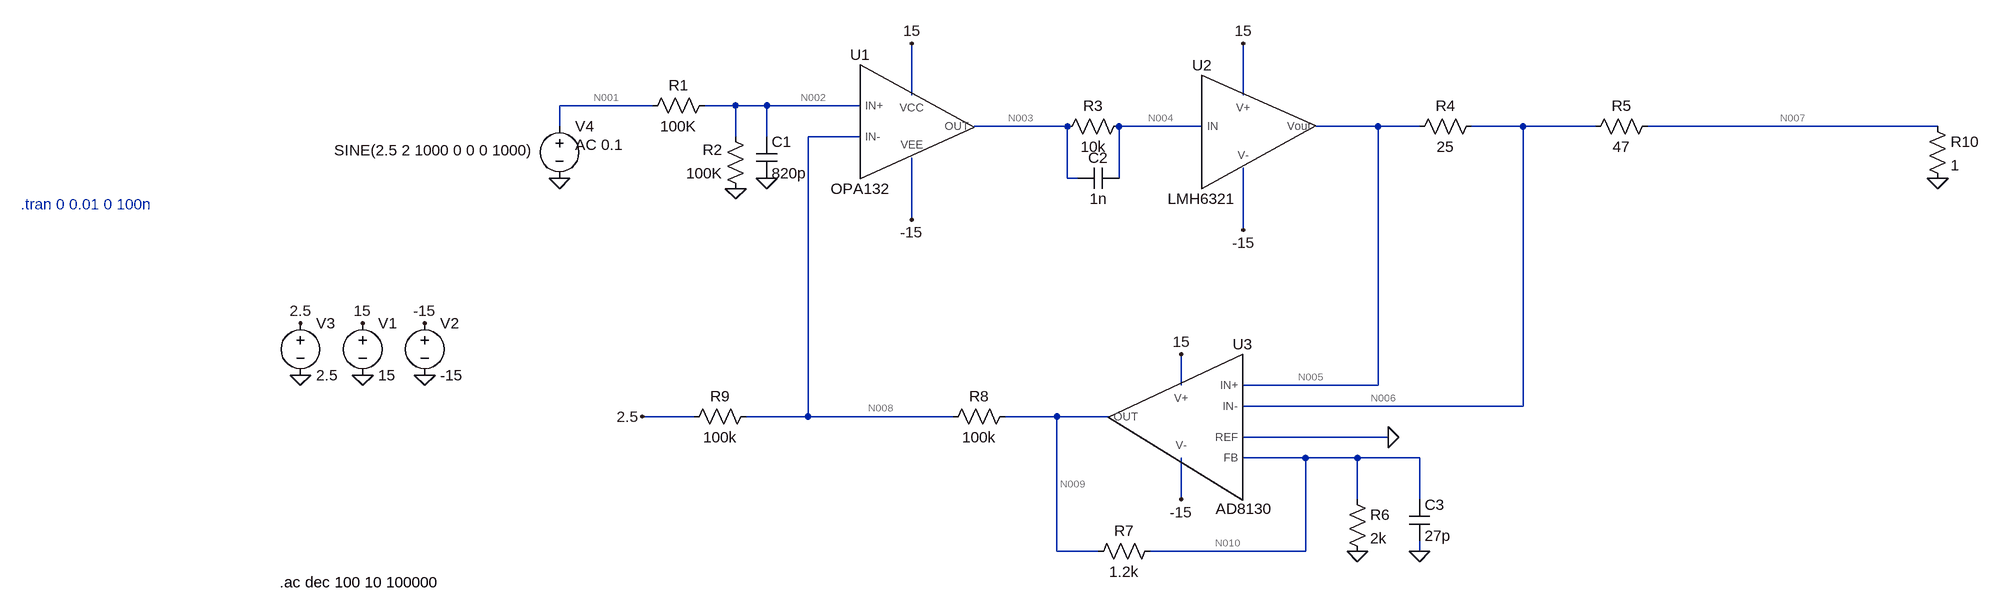
[diagram p0: schematic current_driver_OLoop.asc]
current_driver_OLoop.asc, the LTspice schematic file:
Version 4
SHEET 1 2244 900
WIRE 592 128 592 48
WIRE 1104 128 1104 48
WIRE 192 144 48 144
WIRE 320 144 272 144
WIRE 368 144 320 144
WIRE 512 144 368 144
WIRE 48 176 48 144
WIRE 832 176 688 176
WIRE 1040 176 912 176
WIRE 1312 176 1216 176
WIRE 1376 176 1312 176
WIRE 1536 176 1456 176
WIRE 1648 176 1536 176
WIRE 2176 176 1728 176
WIRE 320 192 320 144
WIRE 368 192 368 144
WIRE 512 192 432 192
WIRE 832 256 832 176
WIRE 848 256 832 256
WIRE 912 256 912 176
WIRE 592 320 592 224
WIRE 1104 336 1104 240
WIRE 1008 576 1008 528
WIRE 1312 576 1312 176
WIRE 1312 576 1104 576
WIRE 1536 608 1536 176
WIRE 1536 608 1104 608
WIRE 256 624 176 624
WIRE 432 624 432 192
WIRE 432 624 336 624
WIRE 656 624 432 624
WIRE 816 624 736 624
WIRE 896 624 816 624
WIRE 1328 656 1104 656
WIRE 1200 688 1104 688
WIRE 1280 688 1200 688
WIRE 1376 688 1280 688
WIRE 1008 752 1008 688
WIRE 1280 752 1280 688
WIRE 1376 752 1376 688
WIRE 816 832 816 624
WIRE 880 832 816 832
WIRE 1200 832 1200 688
WIRE 1200 832 960 832
WIRE 1376 832 1376 816
FLAG 320 272 0
FLAG 368 256 0
FLAG -256 560 0
FLAG -160 560 0
FLAG -256 480 15
FLAG -160 480 -15
FLAG 592 48 15
FLAG 592 320 -15
FLAG 1104 48 15
FLAG 1104 336 -15
FLAG 1328 656 0
FLAG 1280 832 0
FLAG 1376 832 0
FLAG -352 560 0
FLAG -352 480 2.5
FLAG 176 624 2.5
FLAG 2176 256 0
FLAG 48 256 0
FLAG 1008 528 15
FLAG 1008 752 -15
SYMBOL res 288 128 R90
WINDOW 0 0 56 VBottom 2
WINDOW 3 32 56 VTop 2
SYMATTR InstName R1
SYMATTR Value 100K
SYMBOL res 336 288 R180
WINDOW 0 36 76 Left 2
WINDOW 3 36 40 Left 2
SYMATTR InstName R2
SYMATTR Value 100K
SYMBOL cap 352 192 R0
SYMATTR InstName C1
SYMATTR Value 820p
SYMBOL voltage -256 464 R0
WINDOW 123 0 0 Left 2
WINDOW 39 0 0 Left 2
SYMATTR InstName V1
SYMATTR Value 15
SYMBOL voltage -160 464 R0
WINDOW 123 0 0 Left 2
WINDOW 39 0 0 Left 2
SYMATTR InstName V2
SYMATTR Value -15
SYMBOL res 928 160 R90
WINDOW 0 0 56 VBottom 2
WINDOW 3 32 56 VTop 2
SYMATTR InstName R3
SYMATTR Value 10k
SYMBOL cap 912 240 R90
WINDOW 0 0 32 VBottom 2
WINDOW 3 32 32 VTop 2
SYMATTR InstName C2
SYMATTR Value 1n
SYMBOL AutoGenerated\\OPA132 592 160 R0
SYMATTR InstName U1
SYMBOL AutoGenerated\\LMH6321 1104 176 R0
SYMATTR InstName U2
SYMBOL res 1472 160 R90
WINDOW 0 0 56 VBottom 2
WINDOW 3 32 56 VTop 2
SYMATTR InstName R4
SYMATTR Value 25
SYMBOL res 1744 160 R90
WINDOW 0 0 56 VBottom 2
WINDOW 3 32 56 VTop 2
SYMATTR InstName R5
SYMATTR Value 47
SYMBOL AutoGenerated\\AD8130 1072 640 M0
SYMATTR InstName U3
SYMBOL res 1264 736 R0
SYMATTR InstName R6
SYMATTR Value 2k
SYMBOL cap 1360 752 R0
SYMATTR InstName C3
SYMATTR Value 27p
SYMBOL res 976 816 R90
WINDOW 0 0 56 VBottom 2
WINDOW 3 32 56 VTop 2
SYMATTR InstName R7
SYMATTR Value 1.2k
SYMBOL res 752 608 R90
WINDOW 0 0 56 VBottom 2
WINDOW 3 32 56 VTop 2
SYMATTR InstName R8
SYMATTR Value 100k
SYMBOL res 352 608 R90
WINDOW 0 0 56 VBottom 2
WINDOW 3 32 56 VTop 2
SYMATTR InstName R9
SYMATTR Value 100k
SYMBOL voltage -352 464 R0
WINDOW 123 0 0 Left 2
WINDOW 39 0 0 Left 2
SYMATTR InstName V3
SYMATTR Value 2.5
SYMBOL res 2160 160 R0
SYMATTR InstName R10
SYMATTR Value 1
SYMBOL voltage 48 160 R0
WINDOW 3 -348 53 Left 2
WINDOW 123 24 44 Left 2
WINDOW 39 0 0 Left 2
SYMATTR Value SINE(2.5 2 1000 0 0 0 1000)
SYMATTR Value2 AC 0.1
SYMATTR InstName V4
TEXT -384 880 Left 2 !.ac dec 100 10 100000
TEXT -784 296 Left 2 ;.tran 0 0.01 0 100n

The netlist it stands for:
* current_driver_OLoop.asc
R1 N002 N001 100K
R2 0 N002 100K
C1 N002 0 820p
V1 15 0 15
V2 -15 0 -15
R3 N004 N003 10k
C2 N004 N003 1n
XU1 N002 N008 15 -15 N003 OPA132  ; pins IN+ IN- VCC VEE OUT
XU2 N004 15 -15 N005 LMH6321  ; pins IN V+ V- Vout
R4 N006 N005 25
R5 N007 N006 47
XU3 N005 N006 0 N010 15 -15 N009 AD8130  ; pins IN+ IN- REF FB V+ V- OUT
R6 N010 0 2k
C3 N010 0 27p
R7 N010 N009 1.2k
R8 N009 N008 100k
R9 N008 2.5 100k
V3 2.5 0 2.5
R10 N007 0 1
V4 N001 0 SINE(2.5 2 1000 0 0 0 1000) AC 0.1
.ac dec 100 10 100000
* .tran 0 0.01 0 100n
.lib C:\Users\Jorge\Desktop\OPA132.LIB
.lib C:\Users\Jorge\Desktop\LMH6321.MOD
.lib C:\Users\Jorge\Desktop\ad8130.cir
.backanno
.end

* Results of the author's LTspice run, read from the files saved beside the schematic
* Operating Point, zero values left out:
*   V(n002) = 1.25 V
*   V(n001) = 2.5 V
*   V(15) = 15 V
*   V(-15) = -15 V
*   V(n004) = -6.616 mV
*   V(n003) = -22.02 mV
*   V(n008) = 1.25 V
*   V(n005) = -9.83 mV
*   V(n006) = -6.471 mV
*   V(n007) = -134.8 µV
*   V(n010) = -360.5 µV
*   V(n009) = 524.8 µV
*   V(2.5) = 2.5 V
*   I(R10) = -134.8 µA
*   I(R9) = -12.5 µA
*   I(R8) = -12.5 µA
*   I(R7) = -737.7 nA
*   I(R6) = -180.2 nA
*   I(R5) = 134.8 µA
*   I(R4) = 134.4 µA
*   I(R3) = 1.54 µA
*   I(R2) = -12.5 µA
*   I(R1) = -12.5 µA
*   I(V4) = -12.5 µA
*   I(V3) = -12.5 µA
*   I(V2) = 28.43 mA
*   I(V1) = -28.28 mA
*   Ix(u1:IN+) = 11.35 pA
*   Ix(u1:IN-) = 9.015 pA
*   Ix(u1:VCC) = 4 mA
*   Ix(u1:VEE) = -4.002 mA
*   Ix(u1:OUT) = 1.54 µA
*   Ix(u2:3) = -1.54 µA
*   Ix(u2:77) = 9.79 mA
*   Ix(u2:44) = -9.922 mA
*   Ix(u2:6) = 133.8 µA
*   Ix(u3:1) = 578.8 nA
*   Ix(u3:2) = 420.7 nA
*   Ix(u3:3) = 1.08 µA
*   Ix(u3:4) = 918 nA
*   Ix(u3:99) = 14.49 mA
*   Ix(u3:50) = -14.51 mA
*   Ix(u3:45) = 11.76 µA
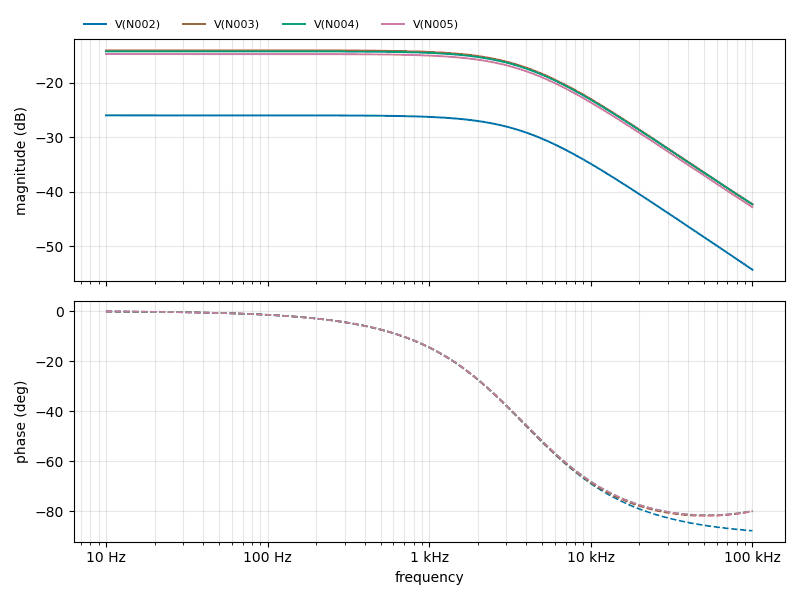
[diagram p1: AC Analysis of current_driver_OLoop.asc, plotted from the saved traces]
* AC Analysis, 1 run:
*   V(N002): -26.02 dB at 10 Hz, -54.31 dB at 100 kHz, peak -26.02 dB at 10 Hz, 3 dB below the peak at 3.853 kHz
*   V(N003): -14.12 dB at 10 Hz, -42.31 dB at 100 kHz, peak -14.12 dB at 10 Hz, 3 dB below the peak at 3.847 kHz
*   V(N004): -14.28 dB at 10 Hz, -42.35 dB at 100 kHz, peak -14.28 dB at 10 Hz, 3 dB below the peak at 3.854 kHz
*   V(N005): -14.78 dB at 10 Hz, -42.85 dB at 100 kHz, peak -14.78 dB at 10 Hz, 3 dB below the peak at 3.854 kHz